# EAGLE design UTX-2022F010 (EAGLE 9.6.2)
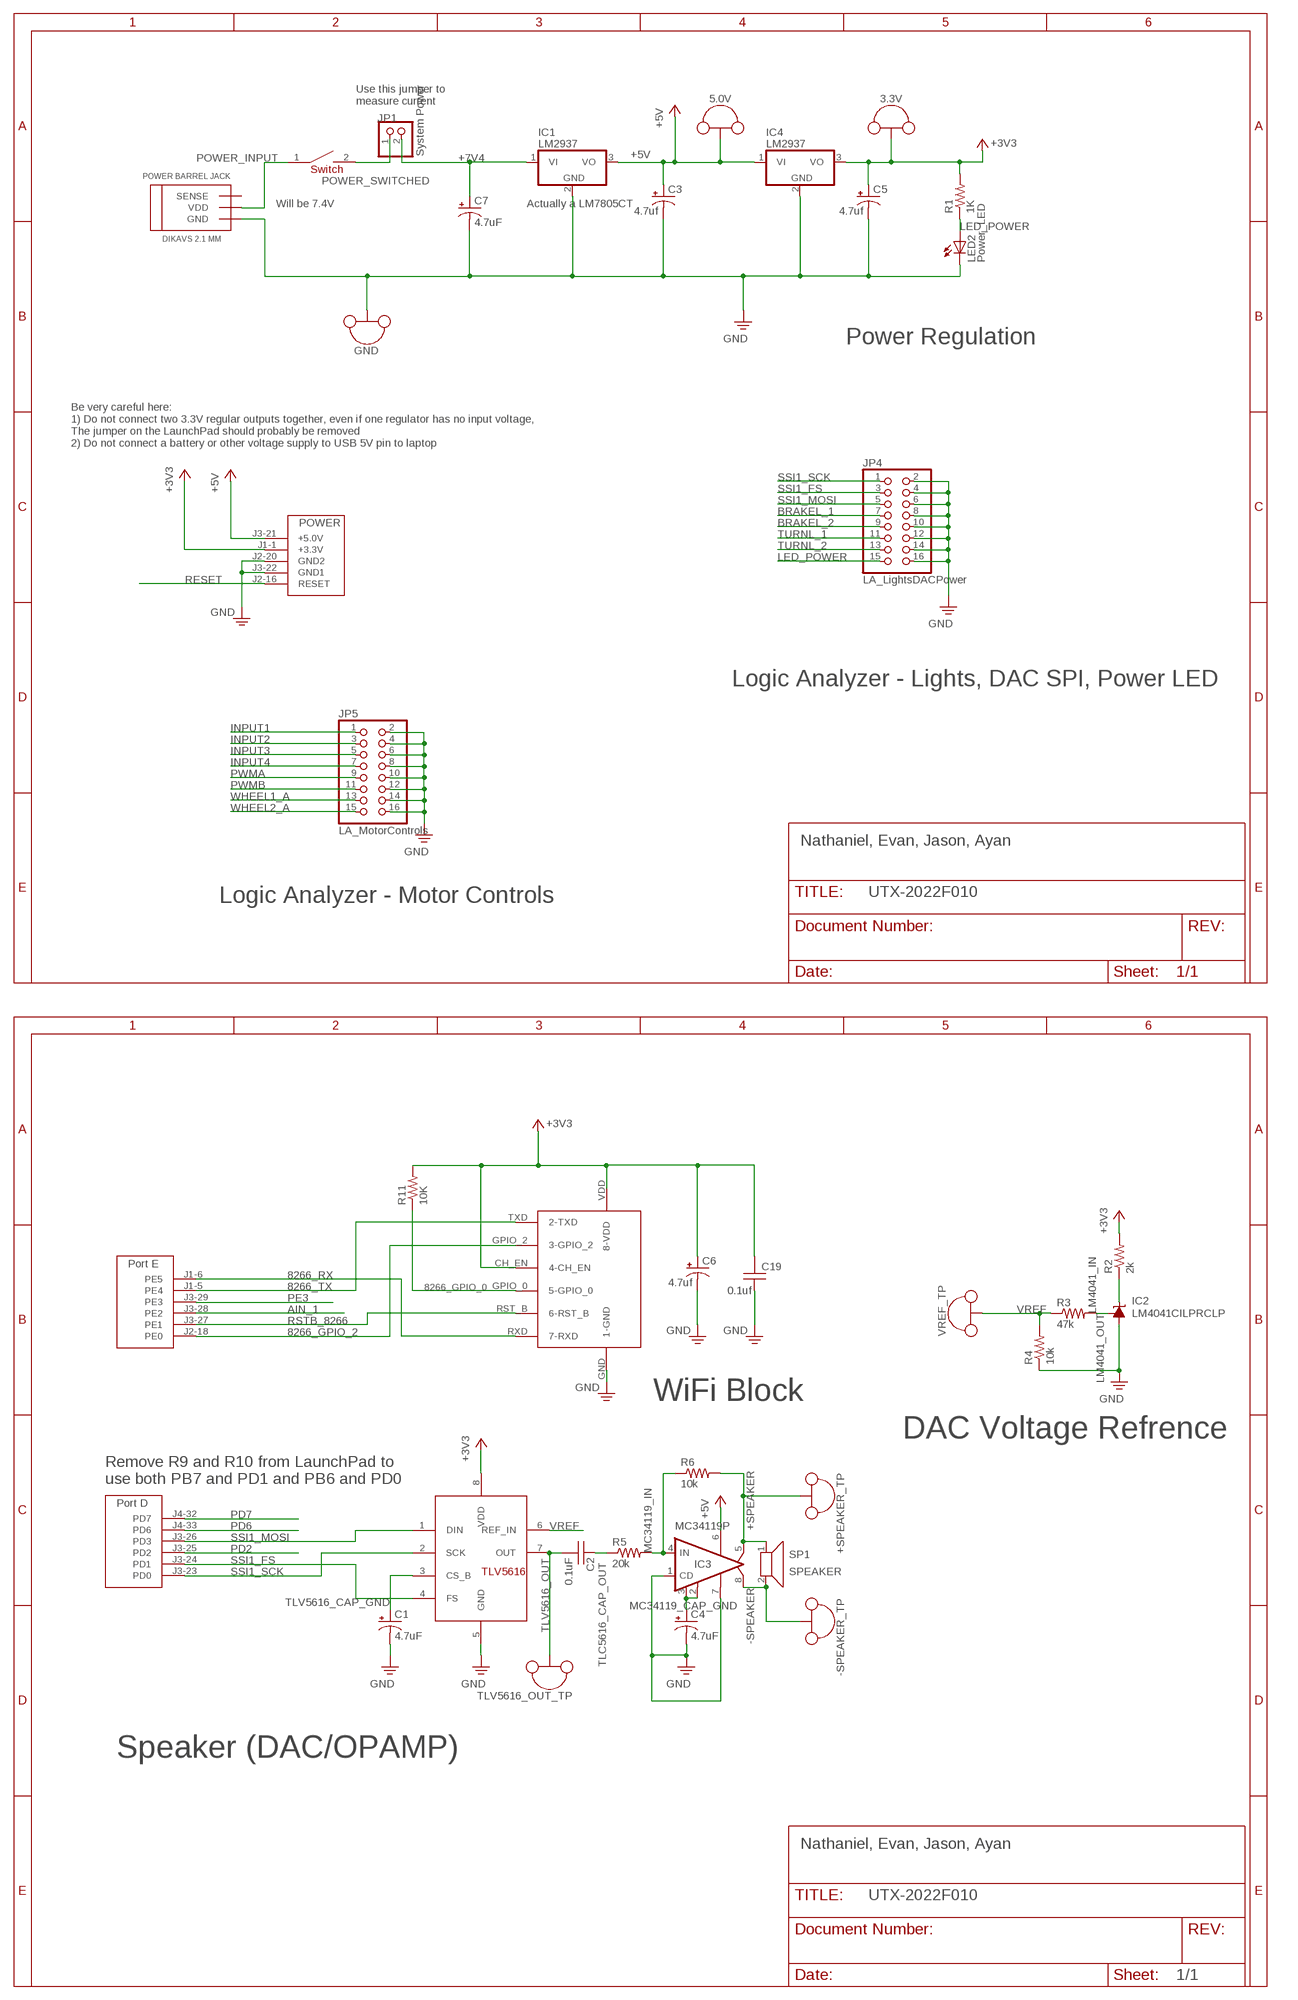
[diagram p0: schematic, sheet 1, part 1 of 2]
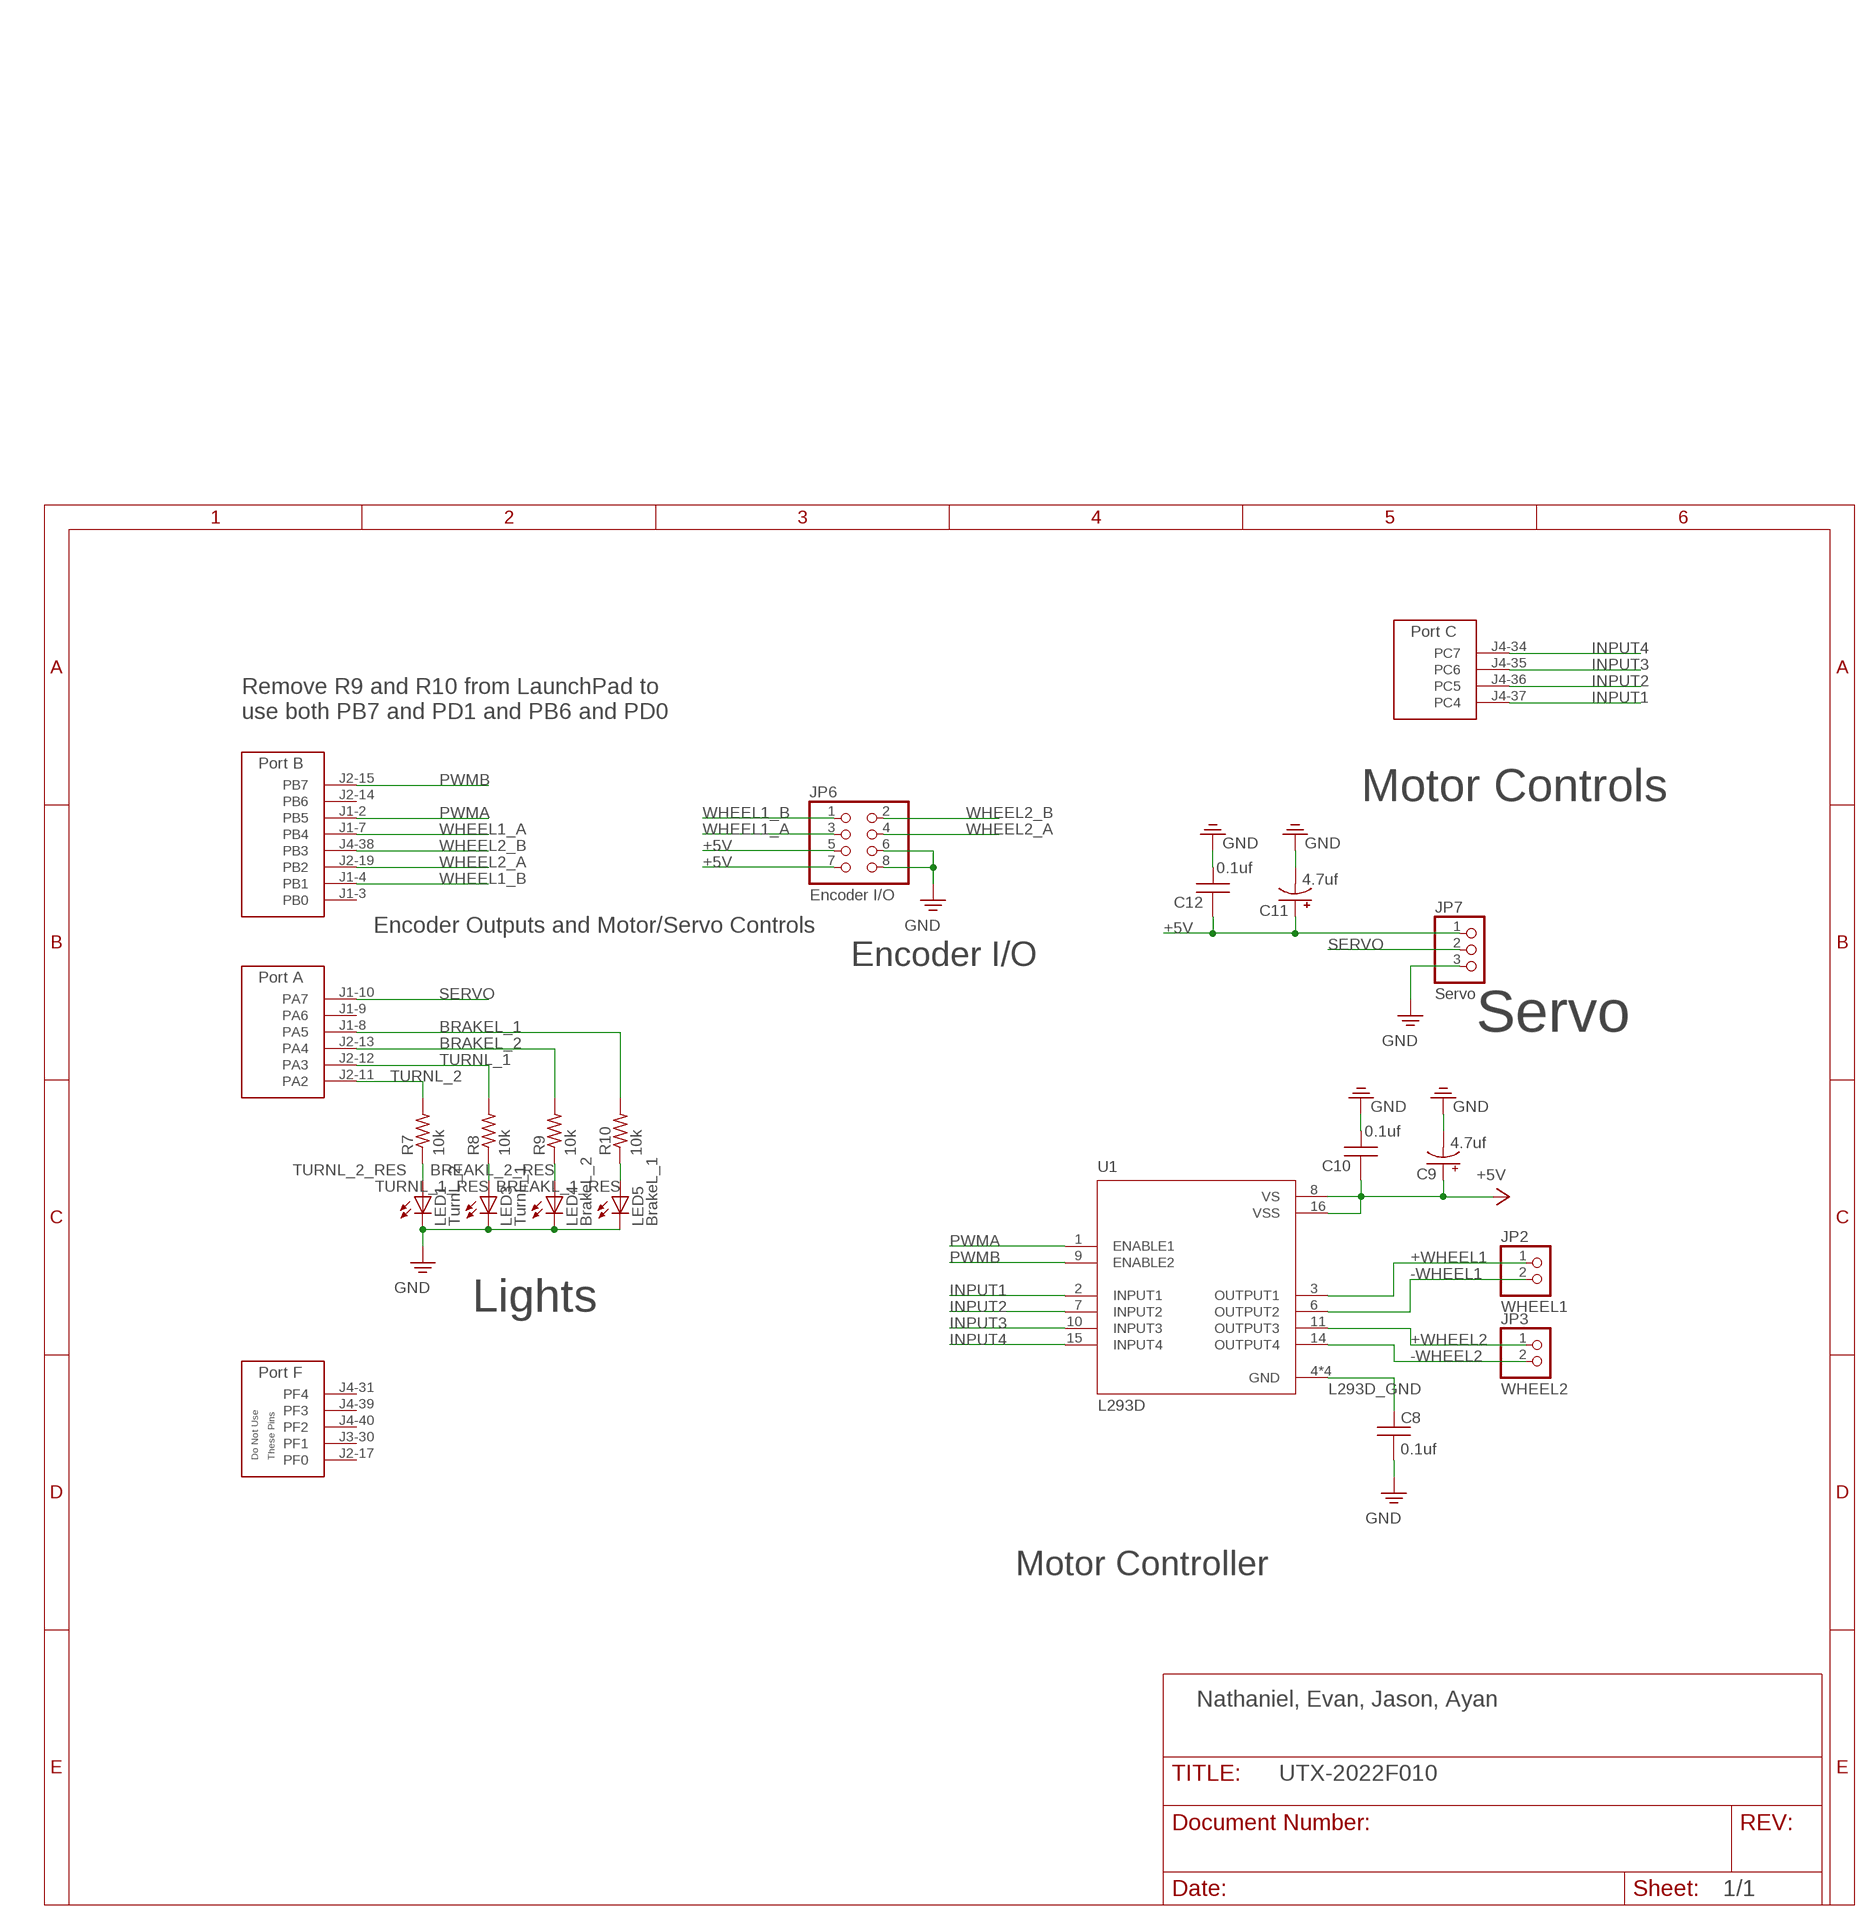
[diagram p1: schematic, sheet 1, part 2 of 2]

## Parts
3.3V  TP_LOOP  [TP_LOOP]
5.0V  TP_LOOP  [TP_LOOP]
+SPEAKER_TP  TP_LOOP  [TP_LOOP]
-SPEAKER_TP  TP_LOOP  [TP_LOOP]
C1  4.7uF  CAPACITOR_POLARIZEDE5-6  [CAP200MILPOLARIZED]
C2  0.1uF  CAPACITOR025-024X044  [CAP100MIL]
C3  4.7uf  CAPACITOR_POLARIZEDE5-6  [CAP200MILPOLARIZED]
C4  4.7uF  CAPACITOR_POLARIZEDE5-6  [CAP200MILPOLARIZED]
C5  4.7uf  CAPACITOR_POLARIZEDE5-6  [CAP200MILPOLARIZED]
C6  4.7uf  CAPACITOR_POLARIZEDE5-6  [CAP200MILPOLARIZED]
C7  4.7uF  CAPACITOR_POLARIZEDE5-6  [CAP200MILPOLARIZED]
C8  0.1uf  CAPACITOR025-024X044  [CAP100MIL]
C9  4.7uf  CAPACITOR_POLARIZEDE5-6  [CAP200MILPOLARIZED]
C10  0.1uf  CAPACITOR050-024X044  [CAP200MIL]
C11  4.7uf  CAPACITOR_POLARIZEDE5-6  [CAP200MILPOLARIZED]
C12  0.1uf  CAPACITOR050-024X044  [CAP200MIL]
C19  0.1uf  CAPACITOR050-024X044  [CAP200MIL]
GND  TP_LOOP  [TP_LOOP]
IC1  LM2937  [TO220]
IC2  LM4041CILPRCLP  [LP_O-PBCY-W3]
IC3  MC34119P  [DIL08]
IC4  LM2937  [TO220]
JP1  System Power  PINHD-1X2  [1X02]
JP2  WHEEL1  PINHD-1X2  [1X02]
JP3  WHEEL2  PINHD-1X2  [1X02]
JP4  LA_LightsDACPower  PINHD-2X8  [2X08]
JP5  LA_MotorControls  PINHD-2X8  [2X08]
JP6  Encoder I/O  PINHD-2X4  [2X04]
JP7  Servo  PINHD-1X3  [1X03]
LED1  TurnL_2  LED3MM  [LED3MM]
LED2  Power_LED  LED3MM  [LED3MM]
LED3  TurnL_1  LED3MM  [LED3MM]
LED4  BrakeL_2  LED3MM  [LED3MM]
LED5  BrakeL_1  LED3MM  [LED3MM]
R1  1K  RESISTOR0204/5  [RES200MIL]
R2  2k  RESISTOR0204/5  [RES200MIL]
R3  47k  RESISTOR0204/5  [RES200MIL]
R4  10k  RESISTOR0204/5  [RES200MIL]
R5  20k  RESISTOR0204/5  [RES200MIL]
R6  10k  RESISTOR0204/5  [RES200MIL]
R7  10k  RESISTOR0204/5  [RES200MIL]
R8  10k  RESISTOR0204/5  [RES200MIL]
R9  10k  RESISTOR0204/5  [RES200MIL]
R10  10k  RESISTOR0204/5  [RES200MIL]
R11  10K  RESISTOR0204/7  [RES300MIL]
SP1  SPEAKER  [1X02]
TLV5616_OUT_TP  TP_LOOP  [TP_LOOP]
U1  L293D  [DIP880W50P254L2000H510Q16]
U$1  TLV5616  [DIL08]
U$2  TM4C_BP  [TM4C_BOOSTER_PACK]
U$3  ESP_8266  [ESP8266]
U$4  2.1MM_BARREL_JACK  [2.1M_BARREL_JACK]
U$6  SW_POWER_100MIL  [SW_POWER]
VREF_TP  TP_LOOP  [TP_LOOP]

## Nets
8266_GPIO_0: R11.1 U$3.GPIO_0(5-GPIO_0)
8266_GPIO_2: U$2.J2-18(PE0) U$3.GPIO_2(3-GPIO_2)
8266_RX: U$2.J1-6(PE5) U$3.RXD(7-RXD)
8266_TX: U$2.J1-5(PE4) U$3.TXD(2-TXD)
+3V3: 3.3V.P$1(TP) 3.3V.P$2(TP) C5.+ C6.+ C19.2 IC4.3(VO) R1.2 R2.2 R11.2 U$1.8(VDD) U$2.J1-1(+3.3V) U$3.CH_EN(4-CH_EN) U$3.VDD(8-VDD)
+5V: 5.0V.P$1(TP) 5.0V.P$2(TP) C3.+ C9.+ C10.2 C11.+ C12.2 IC1.3(VO) IC3.6(VCC) IC4.1(VI) JP6.5 JP6.7 JP7.1 U1.8(VS) U1.16(VSS) U$2.J3-21(+5.0V)
+7V4: C7.+ IC1.1(VI) JP1.2
+SPEAKER: +SPEAKER_TP.P$1(TP) +SPEAKER_TP.P$2(TP) IC3.5(VO1) R6.2 SP1.1
+WHEEL1: JP2.1 U1.3(OUTPUT1)
+WHEEL2: JP3.1 U1.11(OUTPUT3)
-SPEAKER: -SPEAKER_TP.P$1(TP) -SPEAKER_TP.P$2(TP) IC3.8(VO2) SP1.2
-WHEEL1: JP2.2 U1.6(OUTPUT2)
-WHEEL2: JP3.2 U1.14(OUTPUT4)
AIN_1: U$2.J3-28(PE2)
BRAKEL_1: JP4.7 R10.2 U$2.J1-8(PA5)
BRAKEL_2: JP4.9 R9.2 U$2.J2-13(PA4)
BREAKL_1_RES: LED5.A R10.1
BREAKL_2_RES: LED4.A R9.1
GND: C1.- C3.- C4.- C5.- C6.- C7.- C8.2 C9.- C10.1 C11.- C12.1 C19.1 GND.P$1(TP) GND.P$2(TP) IC1.2(GND) IC2.3(A) IC3.1(CD) IC3.7(GND) IC4.2(GND) JP4.2 JP4.4 JP4.6 JP4.8 JP4.10 JP4.12 JP4.14 JP4.16 JP5.2 JP5.4 JP5.6 JP5.8 JP5.10 JP5.12 JP5.14 JP5.16 JP6.6 JP6.8 JP7.3 LED1.K(C) LED2.K(C) LED3.K(C) LED4.K(C) LED5.K(C) R4.1 U$1.5(GND) U$2.J2-20(GND2) U$2.J3-22(GND1) U$3.GND(1-GND) U$4.GND
INPUT1: JP5.1 U1.2(INPUT1) U$2.J4-37(PC4)
INPUT2: JP5.3 U1.7(INPUT2) U$2.J4-36(PC5)
INPUT3: JP5.5 U1.10(INPUT3) U$2.J4-35(PC6)
INPUT4: JP5.7 U1.15(INPUT4) U$2.J4-34(PC7)
L293D_GND: C8.1 U1.4(GND) U1.5(GND) U1.12(GND) U1.13(GND)
LED_POWER: JP4.15 LED2.A R1.1
LM4041_IN: IC2.2(C) R2.1
LM4041_OUT: IC2.1(FB) R3.2
MC34119_CAP_GND: C4.+ IC3.2(FC2) IC3.3(FC1)
MC34119_IN: IC3.4(IN) R5.2 R6.1
PD2: U$2.J3-25(PD2)
PD6: U$2.J4-33(PD6)
PD7: U$2.J4-32(PD7)
PE3: U$2.J3-29(PE3)
POWER_INPUT: U$4.VDD U$6.1
POWER_SWITCHED: JP1.1 U$6.2
PWMA: JP5.9 U1.1(ENABLE1) U$2.J1-2(PB5)
PWMB: JP5.11 U1.9(ENABLE2) U$2.J2-15(PB7)
RESET: U$2.J2-16(RESET)
RSTB_8266: U$2.J3-27(PE1) U$3.RST_B(6-RST_B)
SERVO: JP7.2 U$2.J1-10(PA7)
SSI1_FS: JP4.3 U$1.4(FS) U$2.J3-24(PD1)
SSI1_MOSI: JP4.5 U$1.1(DIN) U$2.J3-26(PD3)
SSI1_SCK: JP4.1 U$1.2(SCK) U$2.J3-23(PD0)
TLC5616_CAP_OUT: C2.1 R5.1
TLV5616_CAP_GND: C1.+ U$1.3(CS_B)
TLV5616_OUT: C2.2 TLV5616_OUT_TP.P$1(TP) TLV5616_OUT_TP.P$2(TP) U$1.7(OUT)
TURNL_1: JP4.11 R8.2 U$2.J2-12(PA3)
TURNL_1_RES: LED3.A R8.1
TURNL_2: JP4.13 R7.2 U$2.J2-11(PA2)
TURNL_2_RES: LED1.A R7.1
VREF: R3.1 R4.2 U$1.6(REF_IN) VREF_TP.P$1(TP) VREF_TP.P$2(TP)
WHEEL1_A: JP5.13 JP6.3 U$2.J1-7(PB4)
WHEEL1_B: JP6.1 U$2.J1-4(PB1)
WHEEL2_A: JP5.15 JP6.4 U$2.J2-19(PB2)
WHEEL2_B: JP6.2 U$2.J4-38(PB3)
Unconnected: U$2.J1-3(PB0) U$2.J1-9(PA6) U$2.J2-14(PB6) U$2.J2-17(PF0) U$2.J3-30(PF1) U$2.J4-31(PF4) U$2.J4-39(PF3) U$2.J4-40(PF2) U$4.SENSE

## Notes on the sheet
- Use this jumper to
  measure current
- Will be 7.4V | Actually a LM7805CT
- Power Regulation
- Be very careful here:
  1) Do not connect two 3.3V regular outputs together, even if one regulator has no input voltage,
  The jumper on the LaunchPad should probably be removed
  2) Do not connect a battery or other voltage supply to USB 5V pin to laptop
- Logic Analyzer - Lights, DAC SPI, Power LED
- Nathaniel, Evan, Jason, Ayan
- Logic Analyzer - Motor Controls
- Remove R9 and R10 from LaunchPad to
  use both PB7 and PD1 and PB6 and PD0
- Motor Controls
- Encoder Outputs and Motor/Servo Controls
- Encoder I/O
- Servo
- WiFi Block
- DAC Voltage Refrence
- Remove R9 and R10 from LaunchPad to
  use both PB7 and PD1 and PB6 and PD0
- Lights
- Motor Controller
- Speaker (DAC/OPAMP)
- Nathaniel, Evan, Jason, Ayan
- Nathaniel, Evan, Jason, Ayan

## Library data of the parts
3.3V 5.0V +SPEAKER_TP -SPEAKER_TP GND TLV5616_OUT_TP VREF_TP = EE445L:TP_LOOP
C1 C3-C7 C9 C11 = EE445L:CAPACITOR_POLARIZED: POLARIZED CAPACITOR, American symbol
C2 C8 C10 C12 C19 = EE445L:CAPACITOR: CAPACITOR, American symbol
IC1 IC4 = EE445L:LM2937: LM2937-2.5, LM2937-3.3 400mA and 500mA Voltage Regulators Source: http://cache.national.com/ds/LM/LM2937-2.5.pdf
IC2 = EE445L:LM4041CILPR: PRECISION MICROPOWER SHUNT VOLTAGE REFERENCE Adjustable Output Source: http://focus.ti.com/lit/ds/slcs146e/slcs146e.pdf LM4041CILPR Let R1 be the resistor from Vref to +3.3V Let R2 be the resistor from Vref to FB Let R3 be the resistor from FB to ground Vref = 1.23*(1+R3/R2) Iref=(3.3V-Vref)/R1 - 100uA; MPN: LM4041CILP; OC_FARNELL: 1673945; OC_NEWARK: 50M8856
IC3 = EE445L:MC34119: Low Power Audio Amplifier Motorola
JP1-JP3 = EE445L:PINHD-1X2: PIN HEADER
JP4 JP5 = EE445L:PINHD-2X8: PIN HEADER
JP6 = EE445L:PINHD-2X4: PIN HEADER
JP7 = EE445L:PINHD-1X3: PIN HEADER
LED1-LED5 = EE445L:LED: Avago Technologies LED Green 2mA 5mm diffused, HLMP-4740, Digikey 516-1327-ND Red 1.6V 1mA 5mm diffused, HLMP-D150, Digikey 516-1323-ND Yellow 2mA 5mm diffused, HLMP-4719, Digikey 516-1326-ND Orange 10mA 5mm diffused HLMP-D401, Digikey 516-1330-ND Blue 10mA 5mm diffused
R1-R11 = EE445L:RESISTOR: RESISTOR, American symbol
SP1 = EE445L:SPEAKER: Speaker Connected off PCB with two wires. 32-ohm speaker, AllElectronics, SK-230, http://www.allelectronics.com/make-a-store/item/sk-230/20-mm-32-ohm-speaker/1.html
U1 = L293D:L293D: 4-Channel Motor Driver 24V 16-Pin Power PDIP Tube Check availability <https://pricing.snapeda.com/parts/L293D/STMicroelectronics/view-part?ref=eda>; AVAILABILITY: In Stock; DESCRIPTION: Bipolar Motor Driver - Parallel 16-PowerDIP; MF: STMicroelectronics; MP: L293D; PACKAGE: SOIC-20 STMicroelectronics; PRICE: None; PURCHASE-URL: https://pricing.snapeda.com/search/part/L293D/?ref=eda
U$1 = EE445L:TLV5616
U$2 = EE445L:TM4C_BP
U$3 = EE445L:ESP_8266
U$4 = EE445L:2.1MM_BARREL_JACK
U$6 = EE445L:SW_POWER_100MIL

## Board
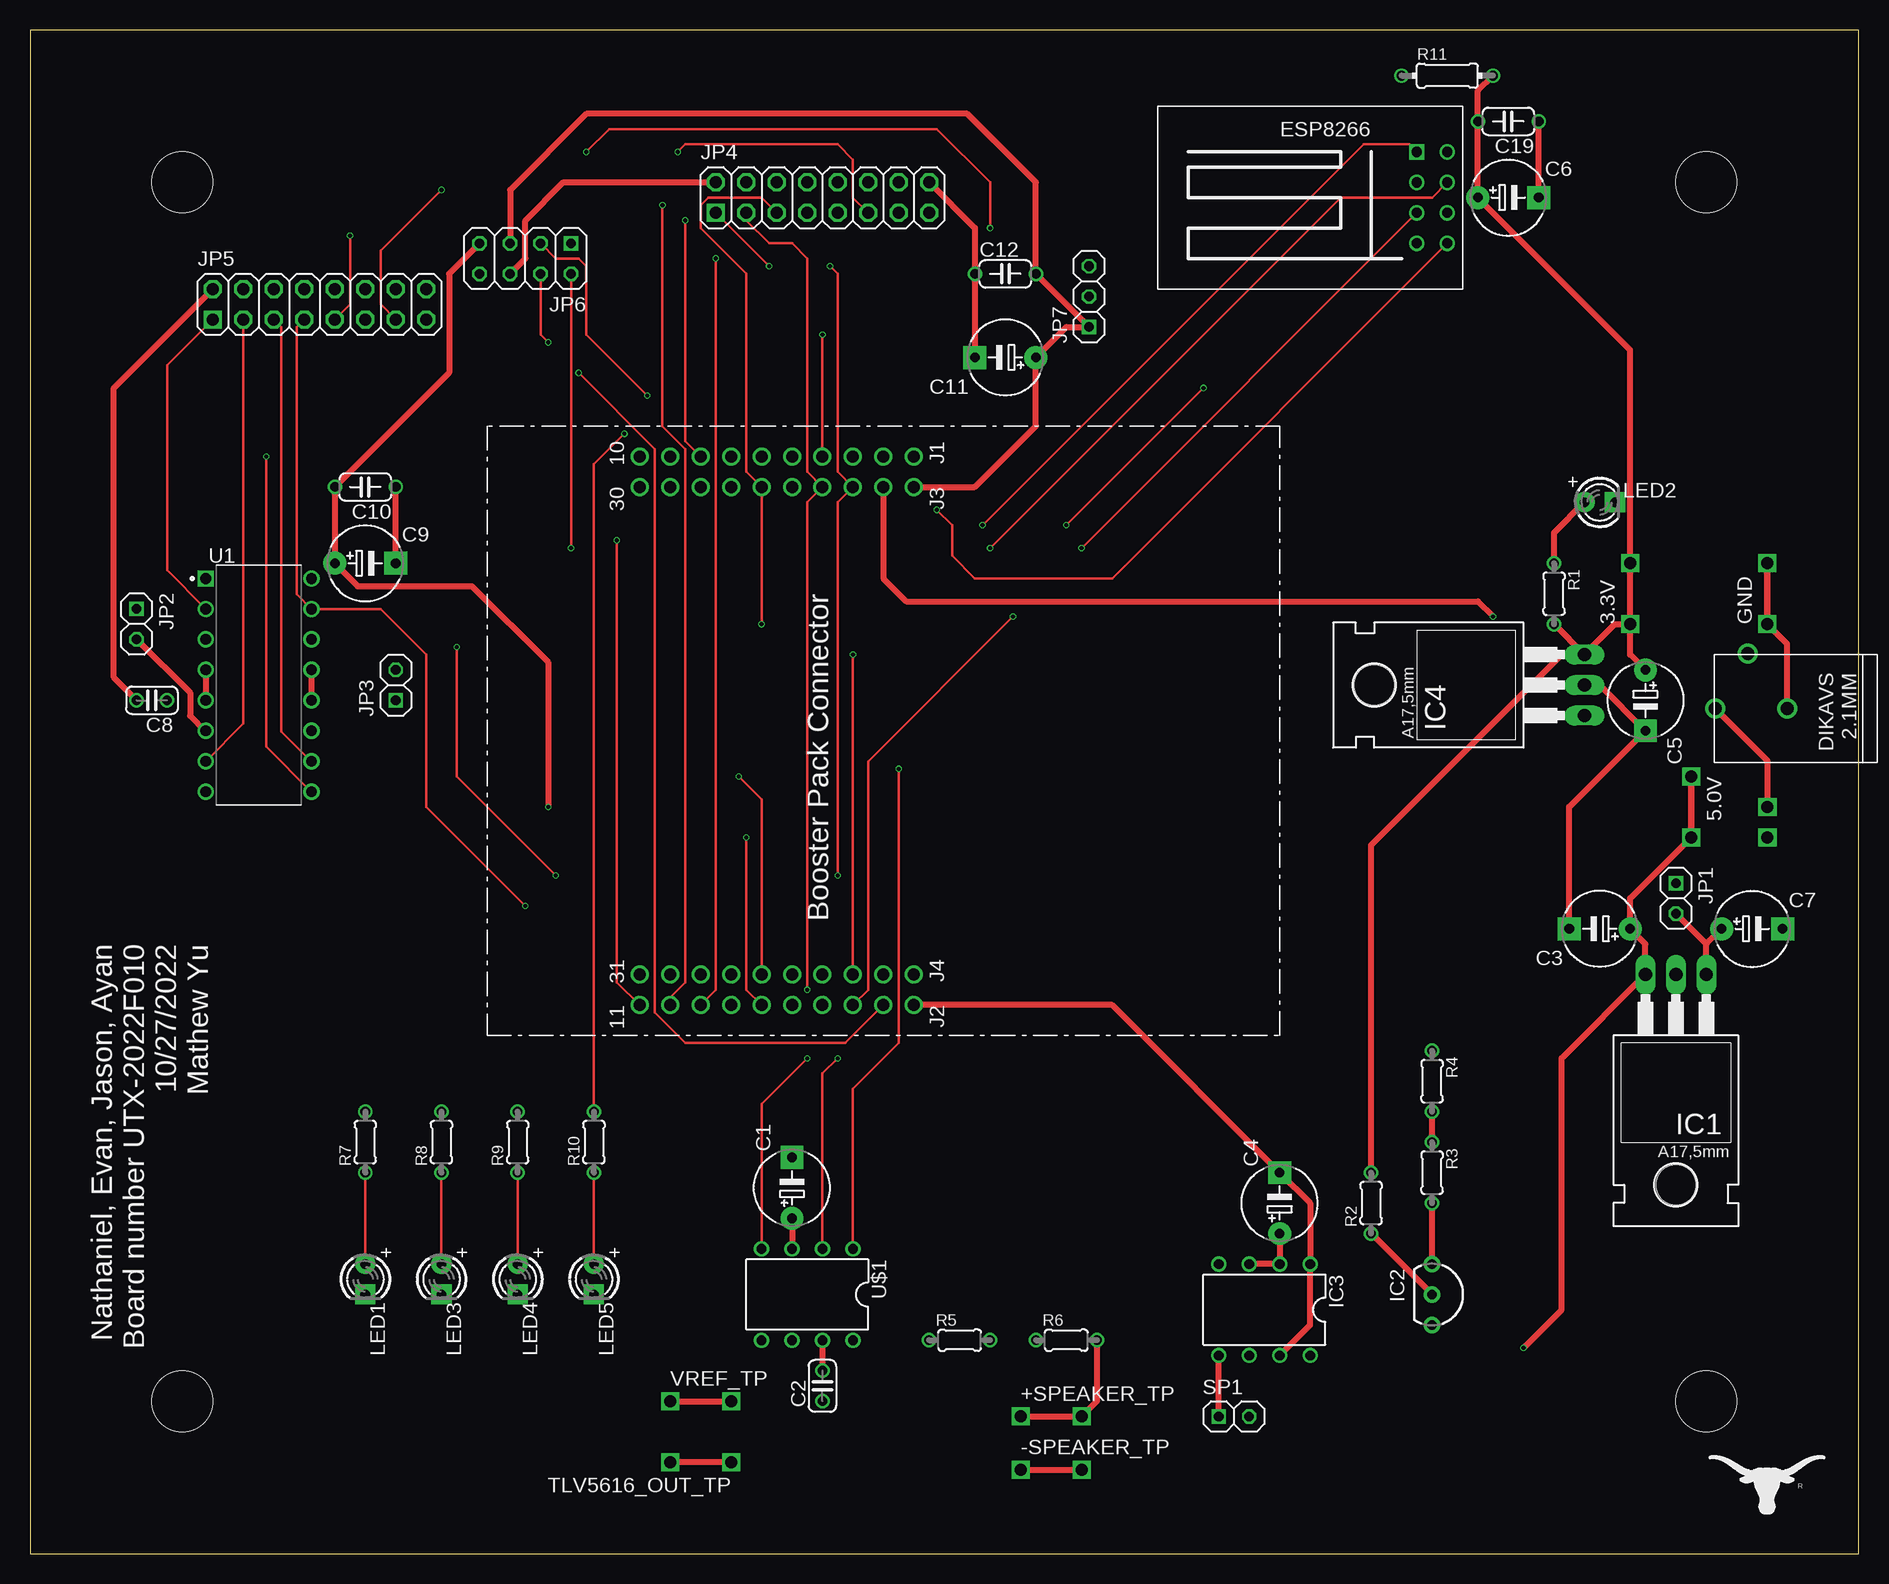
[diagram p2: board, top side]
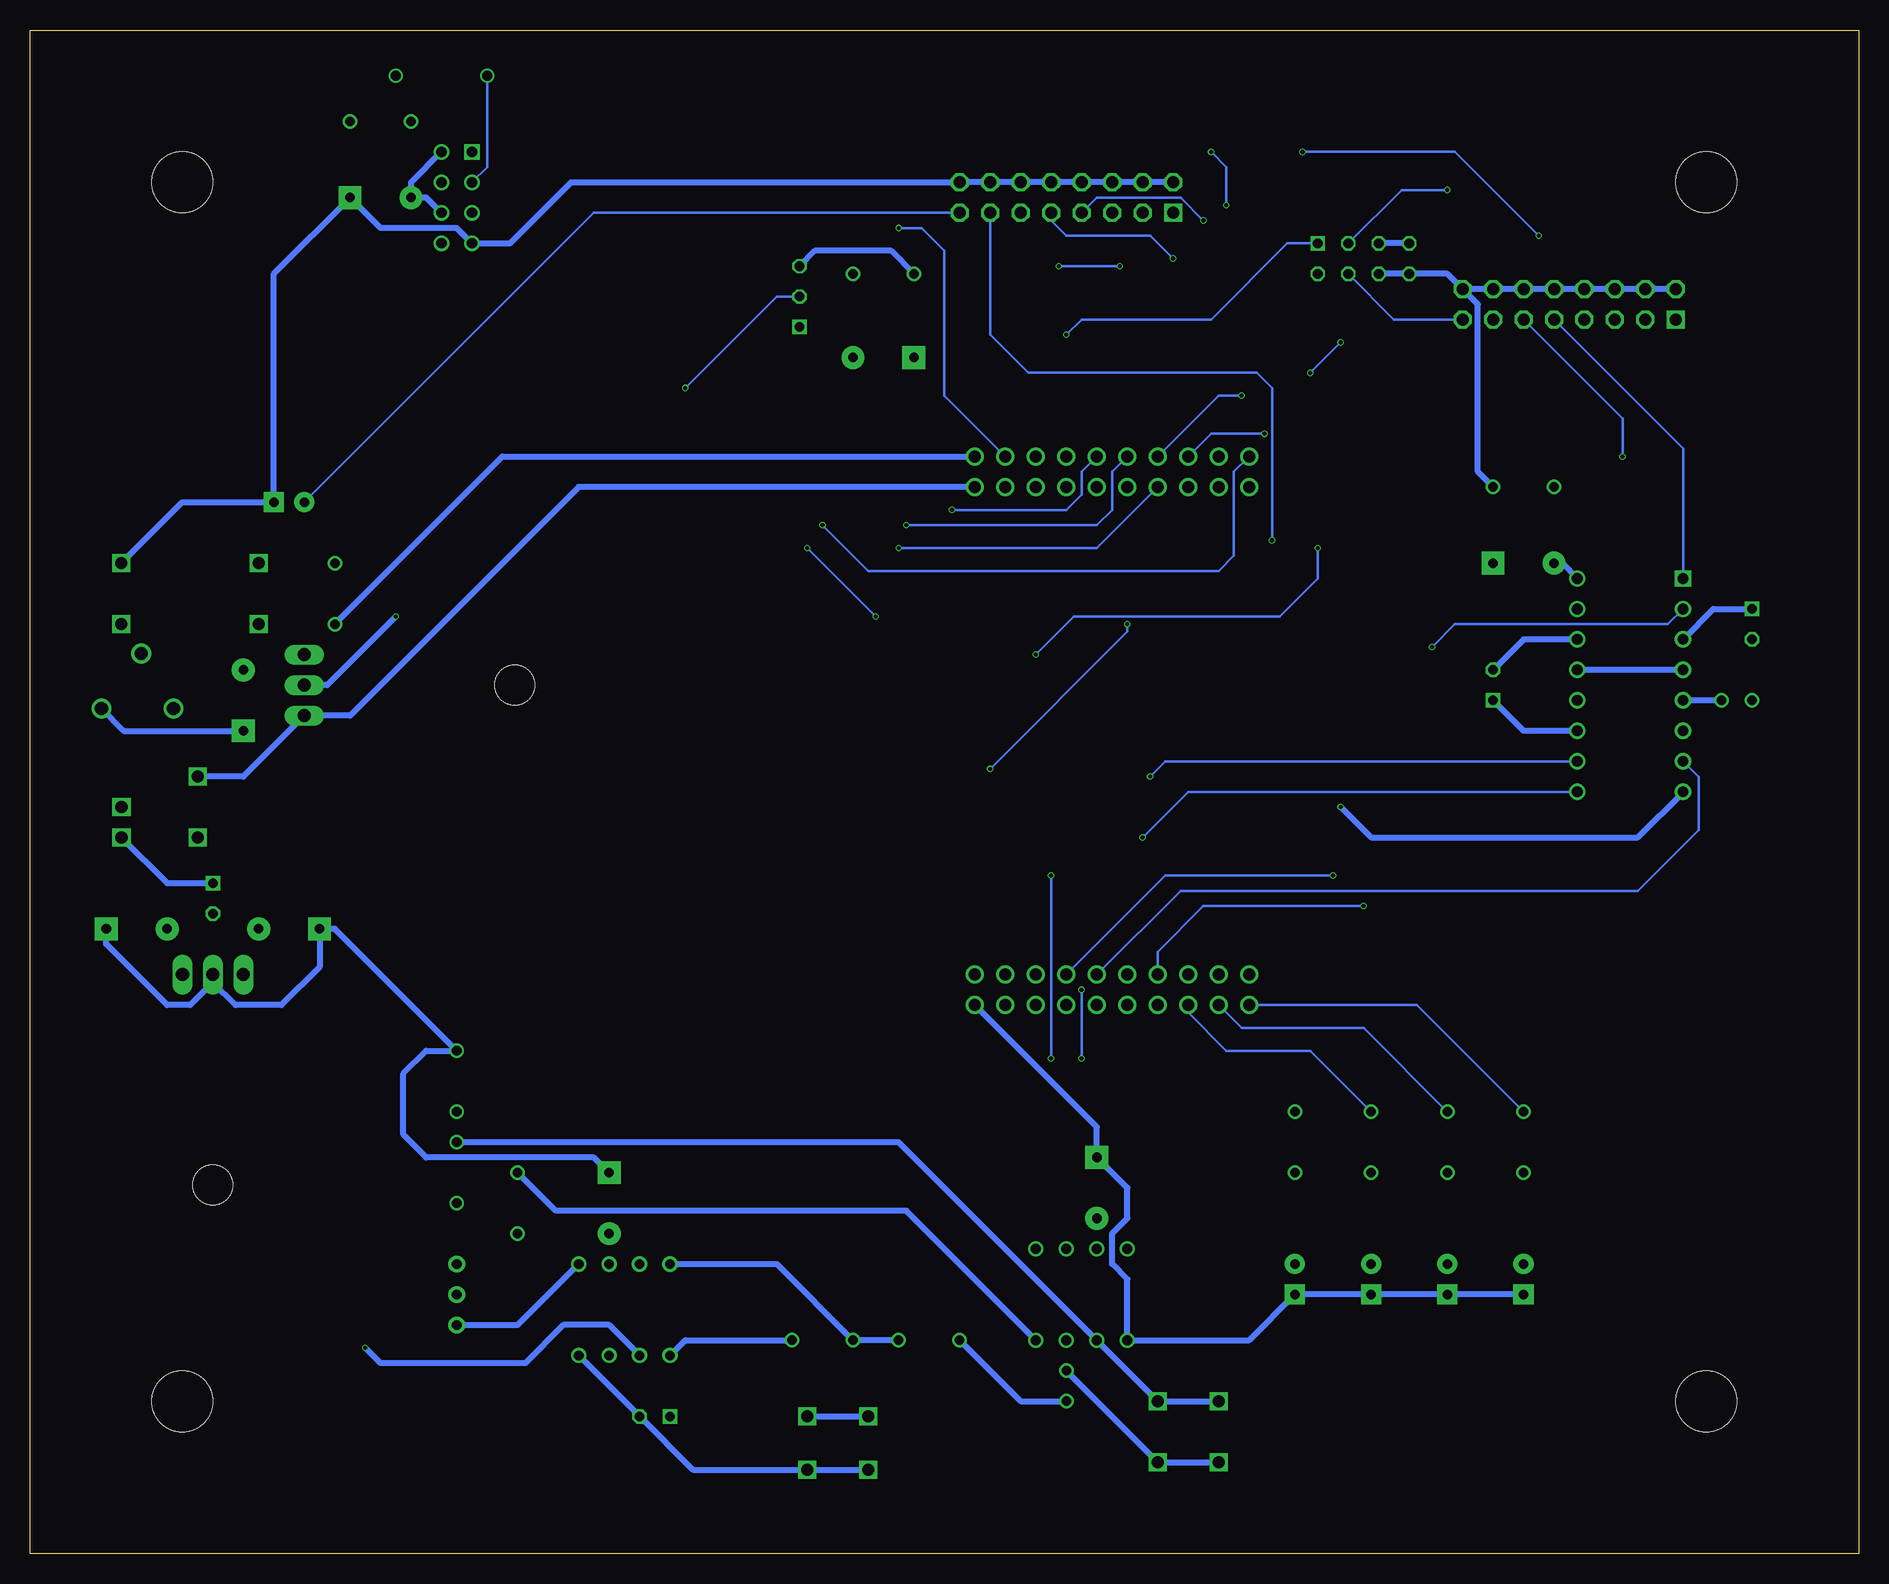
[diagram p3: board, bottom side, seen from below]

Size 152.4 x 127 mm. Coordinates in mm from the lower left corner, seen from the top.
Outline: 0,0 152.4,0 152.4,127 0,127 0,0
Copper layers (1*16): Top 0.035559375mm / dielectric 1.6mm / Bottom 0.035559375mm
Design rules "jlcpcb2layer": minimum track width 5mil, minimum drill 12mil, track to track 5mil, track to pad 5mil, pad to pad 5mil, via to via 5mil, smd to smd 5mil, copper to edge 8mil, drill to drill 6mil, minimum pad ring 5mil, minimum via ring 3mil, stop-mask expansion 2.5mil, vias tented up to drill 0mil, thermal gap 10mil
Holes 5.08 mm at 12.7,114.3 12.7,12.7 139.7,114.3 139.7,12.7

### Footprints (pad centres in the part's own frame; a part is rotated, then mirrored left to right if it is on the bottom)
TP_LOOP = drill 1 square: P$1 0,0; P$2 5.08,0
CAP200MILPOLARIZED = drill 0.8 pad 1.905: + -2.54,0 | drill 0.8 pad 1.905 square: - 2.54,0
CAP100MIL = drill 0.8: 1 -1.27,0; 2 1.27,0
CAP200MIL = drill 0.8: 1 -2.54,0; 2 2.54,0
TO220 = drill 1.1 long: 1 -2.54,-6.35; 2 0,-6.35; 3 2.54,-6.35 | hole 3.302: 0,11.176
LP_O-PBCY-W3 = drill 0.8 pad 1.4: 1 -2.54,0; 2 0,0; 3 2.54,0
DIL08 = drill 0.813 pad 1.27: 1 -3.81,-3.81; 2 -1.27,-3.81; 3 1.27,-3.81; 4 3.81,-3.81; 5 3.81,3.81; 6 1.27,3.81; 7 -1.27,3.81; 8 -3.81,3.81
1X02 = drill 0.8 square: 1 -1.27,0 | drill 0.8 octagon: 2 1.27,0
2X08 = drill 1 square: 1 -8.89,-1.27 | drill 1 octagon: 2 -8.89,1.27; 3 -6.35,-1.27; 4 -6.35,1.27; 5 -3.81,-1.27; 6 -3.81,1.27; 7 -1.27,-1.27; 8 -1.27,1.27; 9 1.27,-1.27; 10 1.27,1.27; 11 3.81,-1.27; 12 3.81,1.27; 13 6.35,-1.27; 14 6.35,1.27; 15 8.89,-1.27; 16 8.89,1.27
2X04 = drill 0.8 square: 1 -3.81,-1.27 | drill 0.8 octagon: 2 -3.81,1.27; 3 -1.27,-1.27; 4 -1.27,1.27; 5 1.27,-1.27; 6 1.27,1.27; 7 3.81,-1.27; 8 3.81,1.27
1X03 = drill 0.8 square: 1 -2.54,0 | drill 0.8 octagon: 2 0,0; 3 2.54,0
LED3MM = drill 0.8 pad 1.676: A -1.27,0 | drill 0.8 pad 1.676 square: K 1.27,0
RES200MIL = drill 0.8: 1 -2.54,0; 2 2.54,0
RES300MIL = drill 0.8: 1 -3.81,0; 2 3.81,0
DIP880W50P254L2000H510Q16 = drill 0.9 pad 1.25 square: 1 -4.4,8.89 | drill 0.9 pad 1.25: 2 -4.4,6.35; 3 -4.4,3.81; 4 -4.4,1.27; 5 -4.4,-1.27; 6 -4.4,-3.81; 7 -4.4,-6.35; 8 -4.4,-8.89; 9 4.4,-8.89; 10 4.4,-6.35; 11 4.4,-3.81; 12 4.4,-1.27; 13 4.4,1.27; 14 4.4,3.81; 15 4.4,6.35; 16 4.4,8.89
TM4C_BOOSTER_PACK = drill 1: J1-1 0,22.86; J1-2 0,20.32; J1-3 0,17.78; J1-4 0,15.24; J1-5 0,12.7; J1-6 0,10.16; J1-7 0,7.62; J1-8 0,5.08; J1-9 0,2.54; J1-10 0,0; J2-11 45.72,0; J2-12 45.72,2.54; J2-13 45.72,5.08; J2-14 45.72,7.62; J2-15 45.72,10.16; J2-16 45.72,12.7; J2-17 45.72,15.24; J2-18 45.72,17.78; J2-19 45.72,20.32; J2-20 45.72,22.86; J3-21 2.54,22.86; J3-22 2.54,20.32; J3-23 2.54,17.78; J3-24 2.54,15.24; J3-25 2.54,12.7; J3-26 2.54,10.16; J3-27 2.54,7.62; J3-28 2.54,5.08; J3-29 2.54,2.54; J3-30 2.54,0; J4-31 43.18,0; J4-32 43.18,2.54; J4-33 43.18,5.08; J4-34 43.18,7.62; J4-35 43.18,10.16; J4-36 43.18,12.7; J4-37 43.18,15.24; J4-38 43.18,17.78; J4-39 43.18,20.32; J4-40 43.18,22.86
ESP8266 = drill 0.85: CH_EN 1.27,-1.27; GND -1.27,-3.81; GPIO_0 -1.27,1.27; GPIO_2 -1.27,-1.27; RST_B 1.27,1.27; TXD 1.27,-3.81; VDD 1.27,3.81 | drill 0.85 square: RXD -1.27,3.81
2.1M_BARREL_JACK = drill 1.1: GND 4.5,6.1; SENSE -0.1,2.8; VDD 4.5,0.1
SW_POWER = drill 1.016 square: 1 -1.27,0; 2 1.27,0

### Placement (x,y rotation side)
3.3V  133.35,77.47 90 top
5.0V  138.43,64.77 270 top
+SPEAKER_TP  82.55,11.43 0 top
-SPEAKER_TP  82.55,6.99 0 top
C1  63.5,30.48 90 top
C2  66.04,13.97 90 top
C3  130.81,52.07 180 top
C4  104.14,29.21 90 top
C5  134.62,71.12 270 top
C6  123.19,113.03 0 top
C7  143.51,52.07 0 top
C8  10.16,71.12 180 top
C9  27.94,82.55 0 top
C10  27.94,88.9 180 top
C11  81.28,99.69 180 top
C12  81.28,106.68 0 top
C19  123.19,119.38 180 top
GND  144.78,77.47 90 top
IC1  137.16,41.91 180 top
IC2  116.84,21.59 270 top
IC3  102.87,20.32 180 top
IC4  123.19,72.39 90 top
JP1  137.16,54.61 270 top
JP2  8.89,77.47 270 top
JP3  30.48,72.39 90 top
JP4  66.04,113.03 0 top
JP5  24.13,104.14 0 top
JP6  41.27,107.95 180 top
JP7  88.27,104.78 90 top
LED1  27.94,22.86 270 top
LED2  130.81,87.63 0 top
LED3  34.29,22.86 270 top
LED4  40.64,22.86 270 top
LED5  46.99,22.86 270 top
R1  127,80.01 270 top
R2  111.76,29.21 90 top
R3  116.84,31.75 270 top
R4  116.84,39.37 270 top
R5  77.47,17.78 0 top
R6  86.36,17.78 0 top
R7  27.94,34.29 90 top
R8  34.29,34.29 90 top
R9  40.64,34.29 90 top
R10  46.99,34.29 90 top
R11  118.11,123.19 0 top
SP1  100.33,11.43 0 top
TLV5616_OUT_TP  58.42,7.62 180 top
U1  19.05,72.39 0 top
U$1  64.77,21.59 180 top
U$2  50.8,91.44 270 top
U$3  116.84,113.03 0 top
U$4  140.34,74.93 270 top
U$6  144.78,60.96 270 top
VREF_TP  53.34,12.7 0 top

### Tracks (layer width: path | path; a pad name or v marks a point on that pad's centre or on a via)
8266_GPIO_0
  Bottom 0.203: R11.1 114.3,115.57 U$3.GPIO_0
8266_GPIO_2  (via drill 0.35)
  Top 0.203: U$3.GPIO_2 v87.63,83.82 | v81.92,78.11 69.85,66.04 69.85,46.99 U$2.J2-18
  Bottom 0.203: v87.63,83.82 v81.92,78.11
8266_RX  (via drill 0.35)
  Top 0.203: v79.38,85.72 111.12,117.47 114.94,117.47 U$3.RXD
  Bottom 0.203: U$2.J1-6 62.23,90.17 62.23,87 63.5,85.72 v79.38,85.72
8266_TX  (via drill 0.35)
  Top 0.203: v75.56,87 76.83,85.72 76.83,83.19 78.74,81.28 90.17,81.28 U$3.TXD
  Bottom 0.203: U$2.J1-5 64.77,90.17 64.77,88.27 66.04,87 v75.56,87
+3V3
  Top 0.508: C5.+ 133.35,74.93 3.3V.P$1 | 3.3V.P$1 3.3V.P$2 133.35,100.33 C6.+ C19.2 120.65,121.92 R11.2 | IC4.3 132.08,77.47 3.3V.P$1 | IC4.3 R1.2 | R2.2 111.76,59.05 127.64,74.93 IC4.3
  Bottom 0.508: R1.2 113.03,91.44 U$2.J1-1 | U$3.VDD 120.65,114.3 C6.+ 119.38,113.03 U$3.CH_EN | U$1.8 79.38,28.57 108.58,28.57 R2.2
+5V  (via drill 0.35)
  Top 0.508: 5.0V.P$1 5.0V.P$2 133.35,54.61 C3.+ 134.62,50.8 IC1.3 127.64,41.27 127.64,20.32 v124.46,17.14 | JP6.7 34.92,106.68 34.92,98.42 C10.2 C9.+ 27.3,80.64 36.83,80.64 43.18,74.3 v43.18,62.23 | U$2.J3-21 78.74,88.9 83.82,93.98 C11.+ 86.36,102.23 JP7.1 C12.2 83.82,114.3 78.11,120.02 46.35,120.02 40.01,113.67 JP6.5
  Bottom 0.508: 5.0V.P$1 134.62,64.77 IC4.1 125.73,69.85 106.68,88.9 U$2.J3-21 | IC3.6 104.14,19.05 107.95,19.05 111.12,15.88 123.19,15.88 v124.46,17.14 | JP6.7 JP6.5 | U1.16 24.72,82.55 C9.+ | v43.18,62.23 40.64,59.69 18.41,59.69 14.65,63.45 U1.8
+7V4
  Top 0.508: IC1.1 139.7,50.8 | 139.7,50.8 C7.+ | 139.7,50.8 JP1.2
+SPEAKER
  Top 0.508: SP1.1 IC3.5 | R6.2 88.9,12.7 +SPEAKER_TP.P$2
  Bottom 0.508: IC3.5 97.79,17.78 R6.2 | +SPEAKER_TP.P$2 +SPEAKER_TP.P$1
+WHEEL1
  Bottom 0.508: U1.3 12.11,78.74 JP2.1
+WHEEL2
  Bottom 0.508: U1.11 27.94,68.58 JP3.1
-SPEAKER
  Bottom 0.508: IC3.8 SP1.2 97.16,6.99 -SPEAKER_TP.P$2 -SPEAKER_TP.P$1
-WHEEL1
  Top 0.508: JP2.2 13.34,71.75 13.34,69.85 14.61,68.58 U1.6
-WHEEL2
  Bottom 0.508: U1.14 27.94,76.2 JP3.2
BRAKEL_1  (via drill 0.35)
  Top 0.203: v49.53,93.34 46.99,90.81 R10.2 | U$2.J1-8 54.61,92.71 v54.61,111.12
  Bottom 0.203: U$2.J1-8 53.98,93.34 v49.53,93.34 | v54.61,111.12 56.52,113.03 63.5,113.03 JP4.7
BRAKEL_2  (via drill 0.35)
  Top 0.203: U$2.J2-13 57.15,46.99 v57.15,107.95
  Bottom 0.203: R9.2 45.72,41.91 52.7,41.91 55.88,45.09 U$2.J2-13 | v57.15,107.95 59.05,109.86 66.04,109.86 67.31,111.12 JP4.9
BREAKL_1_RES
  Top 0.203: LED5.A R10.1
BREAKL_2_RES
  Top 0.203: R9.1 LED4.A
GND  (via drill 0.35)
  Top 0.508: IC4.2 130.81,72.39 C5.- 128.27,62.23 C3.- | GND.P$2 GND.P$1 146.44,75.81 U$4.GND | C6.- C19.1 | IC3.7 106.68,19.05 IC3.1 106.68,29.21 C4.- 90.17,45.72 U$2.J2-20 | C8.2 6.99,73.03 6.99,97.16 JP5.2 | JP6.6 41.27,107.95 41.27,111.12 44.45,114.3 JP4.2 | U$2.J3-22 71.12,81.28 73.03,79.38 120.65,79.38 v121.92,78.11 | C9.- C10.1 | JP4.16 78.74,110.49 C12.1 C11.-
  Bottom 0.508: 137.16,47.62 135.25,45.72 131.44,45.72 128.27,48.9 C3.- 127,52.07 R4.1 119.38,41.91 121.28,40.01 121.28,34.92 119.38,33.02 105.41,33.02 C4.- | IC1.2 137.16,47.62 | C7.- 146.05,50.8 140.97,45.72 139.06,45.72 137.16,47.62 | GND.P$2 139.7,87.63 LED2.K 132.08,106.68 C6.- 123.19,110.49 116.84,110.49 U$3.GND 112.39,109.22 107.31,114.3 JP4.16 JP4.14 JP4.12 JP4.10 JP4.8 JP4.6 JP4.4 JP4.2 | IC2.3 111.76,19.05 IC3.1 | LED1.K LED3.K LED4.K LED5.K 50.8,17.78 U$1.5 60.96,22.86 62.23,24.13 62.23,26.67 60.96,27.94 60.96,30.48 C1.- 63.5,35.56 U$2.J2-20 | JP5.2 JP5.4 JP5.6 JP5.8 JP5.10 JP5.12 JP5.14 JP5.16 | JP5.16 34.29,106.68 JP6.8 JP6.6 | v121.92,78.11 127.64,72.39 IC4.2 | U$4.GND 144.59,68.58 C5.- | C10.1 31.75,90.17 31.75,104.14 JP5.16 | C12.1 80.64,108.58 87,108.58 JP7.3
INPUT1  (via drill 0.35)
  Top 0.203: v43.81,56.52 35.56,64.77 v35.56,75.56 | U1.2 11.43,81.96 11.43,99.06 JP5.1
  Bottom 0.203: U$2.J4-37 57.78,56.52 v43.81,56.52 | v35.56,75.56 33.66,77.47 15.92,77.47 U1.2
INPUT2
  Top 0.203: U1.7 17.78,69.17 JP5.3
  Bottom 0.203: U$2.J4-36 56.52,55.24 18.41,55.24 13.34,60.33 13.34,64.72 U1.7
INPUT3  (via drill 0.35)
  Top 0.203: v59.05,64.77 60.96,62.87 U$2.J4-35 | JP5.5 20.95,102.23 20.95,68.53 U1.10
  Bottom 0.203: U1.10 57.78,66.04 v59.05,64.77
INPUT4  (via drill 0.35)
  Top 0.203: v41.27,53.98 33.02,62.23 33.02,74.93 29.21,78.74 U1.15 22.23,79.97 22.23,102.23 JP5.7
  Bottom 0.203: U$2.J4-34 58.42,50.16 54.61,53.98 v41.27,53.98
L293D_GND
  Top 0.508: U1.4 U1.5 | U1.13 U1.12
  Bottom 0.508: U1.4 U1.13 | C8.1 U1.5
LED_POWER
  Top 0.508: R1.1 127,85.09 LED2.A
  Bottom 0.203: LED2.A 105.41,111.76 JP4.15
LM4041_IN
  Top 0.508: R2.1 IC2.2
LM4041_OUT
  Top 0.508: IC2.1 R3.2
MC34119_CAP_GND
  Top 0.508: C4.+ IC3.2 IC3.3
MC34119_IN
  Bottom 0.508: R5.2 R6.1 90.17,24.13 IC3.4
POWER_INPUT
  Top 0.508: U$4.VDD 144.78,66.08 U$6.1
POWER_SWITCHED
  Bottom 0.508: U$6.2 140.97,55.88 JP1.1
PWMA  (via drill 0.35)
  Top 0.203: v80.01,110.49 80.01,114.3 75.56,118.75 48.26,118.75 v46.35,116.84 | v26.67,109.86 26.67,104.14 JP5.9
  Bottom 0.203: U1.1 14.65,92.12 JP5.9 | U$2.J1-2 76.2,96.52 76.2,108.58 78.11,110.49 v80.01,110.49 | v46.35,116.84 33.66,116.84 v26.67,109.86
PWMB  (via drill 0.35)
  Top 0.203: U$2.J2-15 59.69,46.99 v59.69,59.69 | U1.9 19.68,67.27 v19.68,91.44
  Bottom 0.203: v59.69,59.69 55.88,63.5 U1.9 | v19.68,91.44 19.68,94.61 JP5.11
RSTB_8266  (via drill 0.35)
  Top 0.203: v80.01,83.82 109.22,113.03 116.84,113.03 U$3.RST_B
  Bottom 0.203: U$2.J3-27 63.5,83.82 v80.01,83.82
SERVO  (via drill 0.35)
  Top 0.203: v86.36,85.72 v97.79,97.16
  Bottom 0.203: U$2.J1-10 52.07,90.17 52.07,83.19 53.34,81.92 82.55,81.92 v86.36,85.72 | v97.79,97.16 90.17,104.78 JP7.2
SSI1_FS  (via drill 0.35)
  Top 0.203: U$1.4 60.96,37.47 v64.77,41.27 | v64.77,46.99 64.77,87.63 U$2.J3-24 64.77,90.17 64.77,107.95 63.5,109.22 61.59,109.22 59.69,111.12 JP4.3
  Bottom 0.203: v64.77,41.27 v64.77,46.99
SSI1_MOSI  (via drill 0.35)
  Top 0.203: U$1.1 68.58,38.73 72.39,42.55 v72.39,65.41 | v60.96,77.47 U$2.J3-26 59.69,90.17 59.69,106.68 55.88,110.49 55.88,112.39 56.52,113.03 60.96,113.03 JP4.5
  Bottom 0.203: v72.39,65.41 60.96,76.83 v60.96,77.47
SSI1_SCK  (via drill 0.35)
  Top 0.203: U$1.2 66.04,40.01 v67.31,41.27 | v67.31,56.52 67.31,87.63 U$2.J3-23 67.31,90.17 67.31,106.68 v66.67,107.31 | JP4.1 v61.59,107.31
  Bottom 0.203: v67.31,41.27 v67.31,56.52 | v61.59,107.31 v66.67,107.31
TLC5616_CAP_OUT
  Bottom 0.508: R5.1 69.85,12.7 C2.1
TLV5616_CAP_GND
  Top 0.508: C1.+ U$1.3
TLV5616_OUT
  Top 0.508: U$1.7 C2.2
  Bottom 0.508: C2.2 TLV5616_OUT_TP.P$1 TLV5616_OUT_TP.P$2
TURNL_1  (via drill 0.35)
  Top 0.203: U$2.J2-12 53.34,46.35 54.61,47.62 54.61,92.08 52.7,93.98 v52.7,112.39 | v53.98,116.84 54.61,117.47 67.31,117.47 68.58,116.2 68.58,113.03 JP4.11
  Bottom 0.203: R8.2 41.27,43.81 51.44,43.81 U$2.J2-12 | v52.7,112.39 52.7,115.57 v53.98,116.84
TURNL_1_RES
  Top 0.203: R8.1 LED3.A
TURNL_2  (via drill 0.35)
  Top 0.203: U$2.J2-11 48.9,47.62 v48.9,84.45
  Bottom 0.203: R7.2 36.83,45.72 U$2.J2-11 | v48.9,84.45 48.9,97.16 50.16,98.42 69.22,98.42 72.39,101.6 JP4.13
TURNL_2_RES
  Top 0.203: LED1.A R7.1
VREF
  Top 0.508: R3.1 R4.2
  Bottom 0.508: R3.1 80.01,34.29 U$1.6 VREF_TP.P$2 VREF_TP.P$1
WHEEL1_A  (via drill 0.35)
  Top 0.203: JP5.13 29.21,104.14 29.21,108.58 v34.29,113.67 | v51.44,96.52 46.35,101.6 46.35,107.31 45.72,107.95 43.81,107.95 JP6.3
  Bottom 0.203: v34.29,113.67 38.1,113.67 JP6.3 | U$2.J1-7 53.34,96.52 v51.44,96.52
WHEEL1_B  (via drill 0.35)
  Top 0.203: v66.04,101.6 U$2.J1-4
  Bottom 0.203: JP6.1 47.62,109.22 53.98,102.87 64.77,102.87 v66.04,101.6
WHEEL2_A  (via drill 0.35)
  Top 0.203: JP6.4 42.55,101.6 v43.18,100.97 | U$2.J2-19 67.94,42.55 54.61,42.55 52.07,45.09 52.07,92.08 v45.72,98.42
  Bottom 0.203: JP5.15 38.73,102.87 JP6.4 | v43.18,100.97 v45.72,98.42
WHEEL2_B  (via drill 0.35)
  Top 0.203: U$2.J4-38 v68.58,74.93 | v45.09,83.82 JP6.2
  Bottom 0.203: v68.58,74.93 65.41,78.11 48.26,78.11 45.09,81.28 v45.09,83.82

### Text on the board
tPlace: Nathaniel, Evan, Jason, Ayan / Board number UTX-2022F010 / 10/27/2022 / Mathew Yu | R